# EasyEDA Pro project 3.3VBuck_1117_P1.epro

# Schematic 3.3VBuck_1117
Board Name: Board1; Create Date: 2024-12-15; Page Name: 3.3VBuck_1117_P1; Project Name: 3.3VBuck_1117; Schematic Name: 3.3VBuck_1117; Update Date: 2024-12-16; Company: 嘉立创EDA; Page Size: A4; Version: V1.0
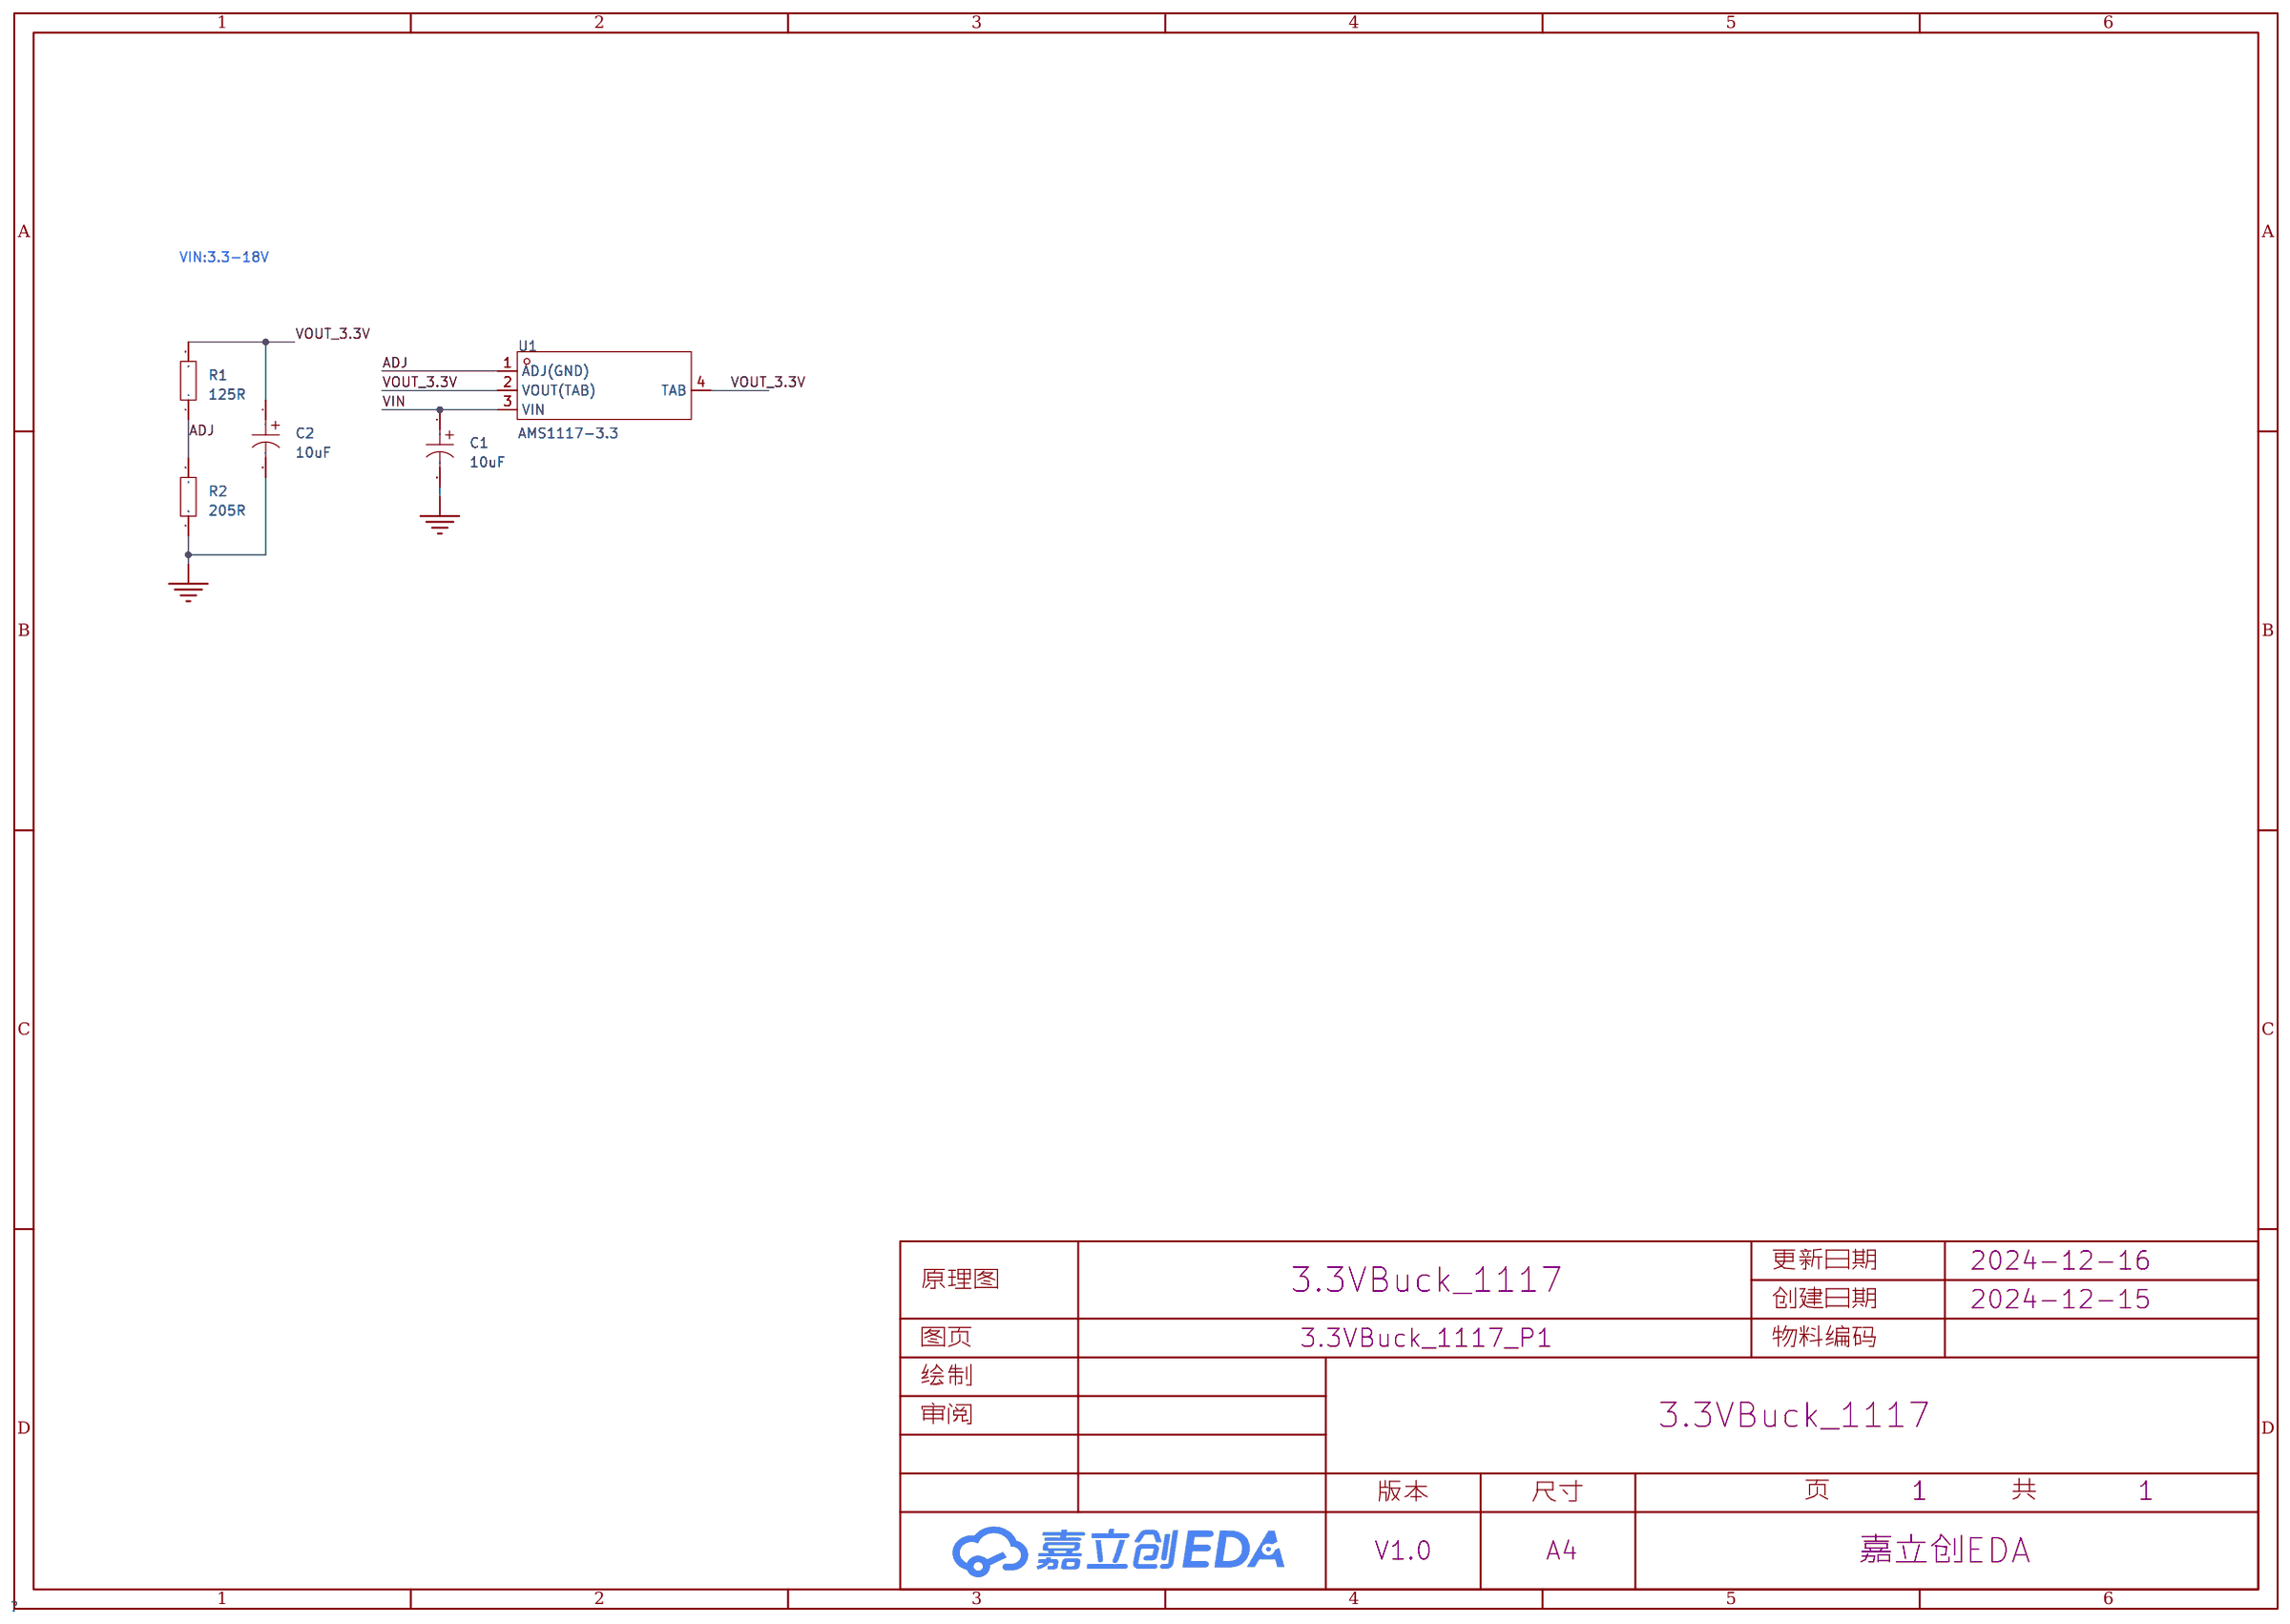
[diagram p0: schematic sheet]

## Parts
C1  10uF  [CAP-SMD_L2.0-W1.3-FD]
C2  10uF  [CAP-SMD_L2.0-W1.3-FD]
R1  125R  [R0805]
R2  205R  [R0805]
U1  AMS1117-3.3  [SOT-223-4_L6.5-W3.5-P2.30-LS7.0-BR]

## Library data of the parts
C1 C2 = TMCP1A106MTRF: 容值:10uF;精度:±20%;额定电压:10V;等效串联电阻:5.9Ω@100kHz;; LCSC Part Name: 10uF ±20% 10V; Supplier Part: C1969735; Manufacturer: VISHAY(威世); Supplier Footprint: 0805; JLCPCB Part Class: 扩展库; Datasheet: https://atta.szlcsc.com/upload/public/pdf/source/20210506/EB7F77920409F8D63FFE94178A7159DC.pdf; Supplier: LCSC; Tolerance: ±20%; Rated Voltage: 10V; Equivalent Series Resistance(ESR): 5.9Ω@100kHz; Operating Temperature: -55℃~+125℃
R1 R2 = Res_0805: Supplier Footprint: 0805
U1 = AMS1117-3.3_C347222: 输出类型:固定;最大输入电压:18V;输出电压:3.3V;输出电流:1A;电源纹波抑制比(PSRR):60dB@(120Hz);输出极性:正极;; LCSC Part Name: 输出:3.3V 电流:1A 耐压:12V; Supplier Part: C347222; Manufacturer: UMW(友台半导体); Supplier Footprint: SOT-223; JLCPCB Part Class: 扩展库; Datasheet: https://atta.szlcsc.com/upload/public/pdf/source/20231109/155D79A26D9DB04352555A58D5969DC8.pdf; Supplier: LCSC; Output Type: 固定; Maximum Input Voltage: 18V; Output Voltage: 3.3V; Output Current: 1A; Power Supply Rejection Ratio (PSRR): 60dB@(120Hz); Dropout Voltage: 1.3V@(1A); Feature: 过流保护(OCP); Output Polarity: 正极; Number of Outputs: 1

## Nets
GND: C1.2 C2.2 R2.1
VIN: C1.1 U1.3(VIN)
ADJ: R1.1 R2.2 U1.1(ADJ(GND))
VOUT_3.3V: C2.1 R1.2 U1.2(VOUT(TAB)) U1.4(TAB)

## Notes on the sheet
- VIN:3.3-18V
